# EAGLE schematic aux power systems (EAGLE 6.5.0)
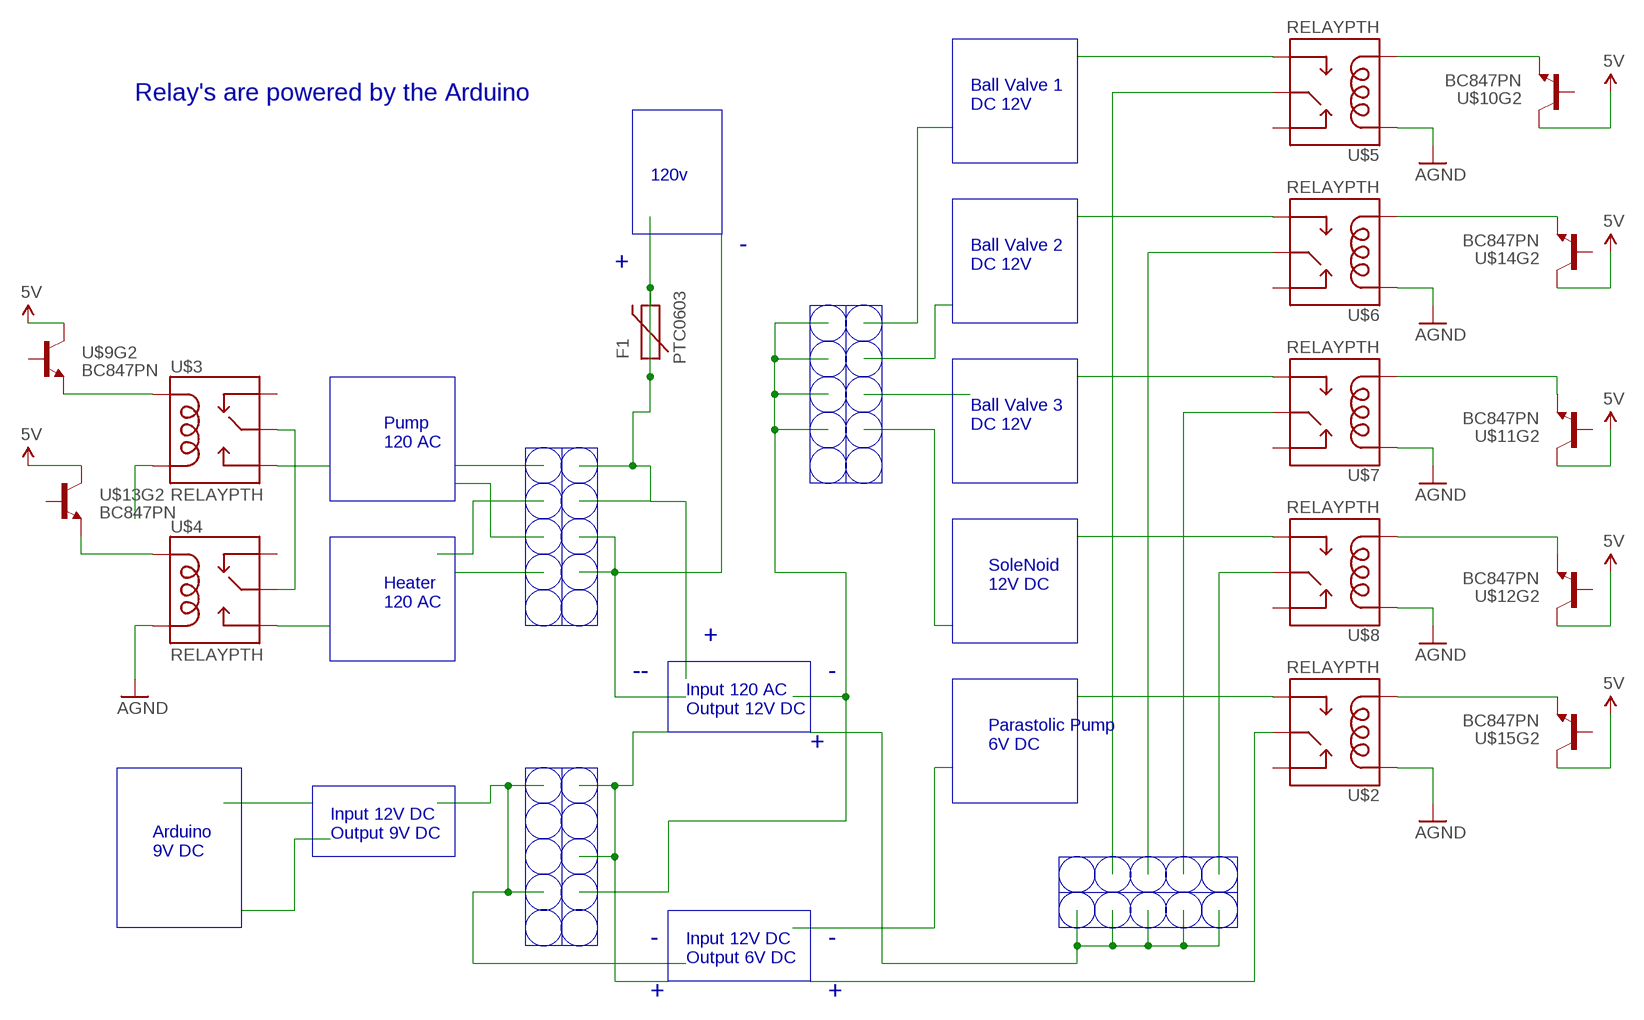
[diagram p0: schematic, sheet 1]

## Parts
F1  PTC0603  [0603]
U$2  RELAYPTH  [RELAY-G5Q]
U$3  RELAYPTH  [RELAY-G5Q]
U$4  RELAYPTH  [RELAY-G5Q]
U$5  RELAYPTH  [RELAY-G5Q]
U$6  RELAYPTH  [RELAY-G5Q]
U$7  RELAYPTH  [RELAY-G5Q]
U$8  RELAYPTH  [RELAY-G5Q]
U$9  BC847PN  [SOT363]
U$10  BC847PN  [SOT363]
U$11  BC847PN  [SOT363]
U$12  BC847PN  [SOT363]
U$13  BC847PN  [SOT363]
U$14  BC847PN  [SOT363]
U$15  BC847PN  [SOT363]

## Nets
5V: U$9.3(C) U$10.3(C) U$11.3(C) U$12.3(C) U$13.3(C) U$14.3(C) U$15.3(C)
AGND: U$2.5(COIL1) U$4.1(COIL2) U$5.5(COIL1) U$6.5(COIL1) U$7.5(COIL1) U$8.5(COIL1)
B$2: U$2.3(NO) U$3.3(NO) U$4.3(NO) U$5.3(NO) U$6.3(NO) U$7.3(NO) U$8.3(NO)
B$3: U$2.2(MAIN) U$7.2(MAIN)
N$1: U$3.5(COIL1) U$9.4(E)
N$2: U$4.5(COIL1) U$13.4(E)
N$3: U$2.1(COIL2) U$15.4(E)
N$4: U$8.1(COIL2) U$12.4(E)
N$5: U$7.1(COIL2) U$11.4(E)
N$6: U$6.1(COIL2) U$14.4(E)
N$7: U$5.1(COIL2) U$10.4(E)
N$8: U$3.2(MAIN) U$4.2(MAIN)
N$10: U$6.2(MAIN)
N$11: U$3.1(COIL2)
N$12: U$8.2(MAIN)
N$14: U$5.2(MAIN)
N$23: F1.1 F1.2
Unconnected: U$2.4(NC) U$3.4(NC) U$4.4(NC) U$5.4(NC) U$6.4(NC) U$7.4(NC) U$8.4(NC) U$9.1(E) U$9.2(B) U$9.5(B) U$9.6(C) U$10.1(E) U$10.2(B) U$10.5(B) U$10.6(C) U$11.1(E) U$11.2(B) U$11.5(B) U$11.6(C) U$12.1(E) U$12.2(B) U$12.5(B) U$12.6(C) U$13.1(E) U$13.2(B) U$13.5(B) U$13.6(C) U$14.1(E) U$14.2(B) U$14.5(B) U$14.6(C) U$15.1(E) U$15.2(B) U$15.5(B) U$15.6(C)

## Buses
B$1
B$2
B$3
B$4
B$5

## Notes on the sheet
- Ball Valve 1
  DC 12V
- Relay's are powered by the Arduino
- 120v
- -
- +
- Ball Valve 2
  DC 12V
- Ball Valve 3
  DC 12V
- Pump
  120 AC
- SoleNoid
  12V DC
- Heater
  120 AC
- +
- -- | -
- Input 120 AC
  Output 12V DC
- +
- Parastolic Pump
  6V DC
- Input 12V DC
  Output 9V DC
- Arduino 
  9V DC
- - | -
- Input 12V DC
  Output 6V DC
- + | +

## Library data of the parts
F1 = SparkFun-PowerIC:PTC: Resettable Fuse PTC Resettable Fuse. Spark Fun Electronics SKU : COM-08357
U$2-U$8 = SparkFun-Electromechanical:RELAY: SPDT relay (COM-00101)
U$9-U$15 = SparkFun-DiscreteSemi:BC847PN: NPN/PNP transistor pair in SOT-363 package